# EAGLE board stages_v70 (EAGLE 9.7.0), part 1 of 2
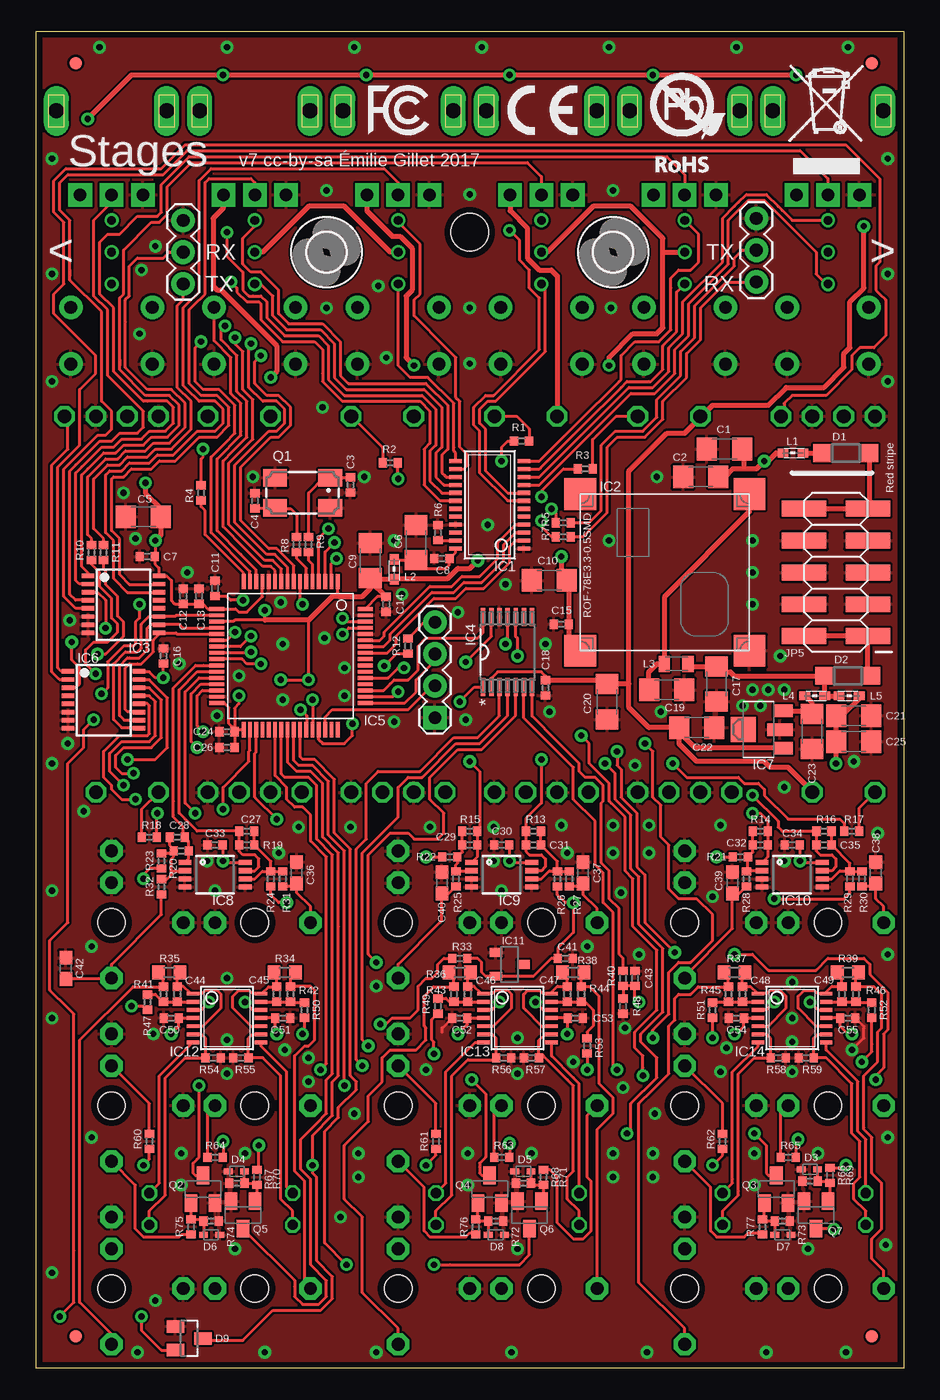
[diagram p6: board, top side]
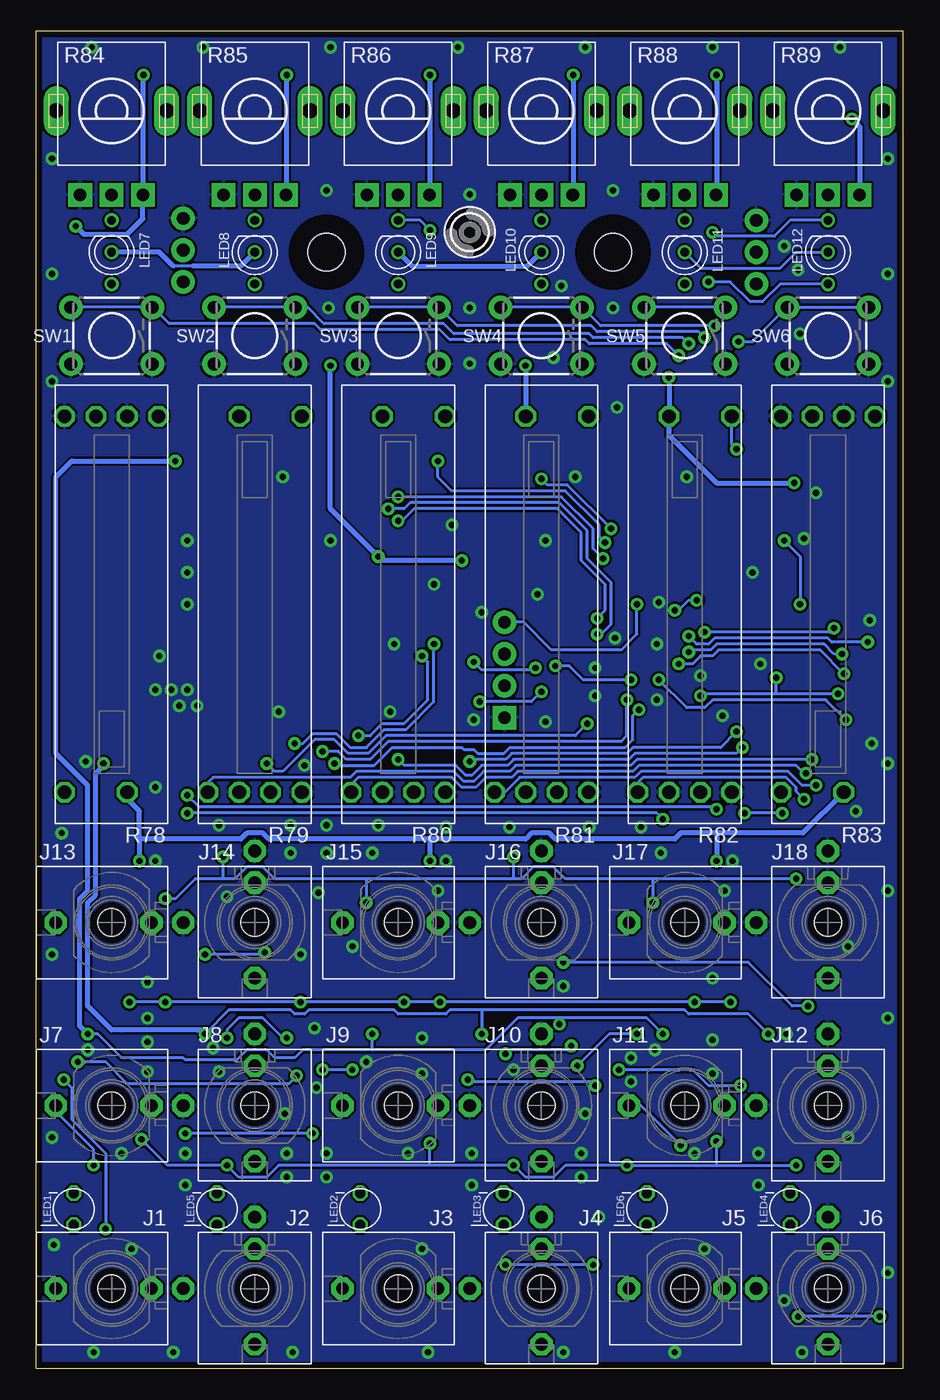
[diagram p7: board, bottom side, seen from below]

Size 69.2 x 106.68 mm. Coordinates in mm from the lower left corner, seen from the top.
Outline: 69.2,0 0,0 0,106.68 69.2,106.68 69.2,0
Copper layers (1*16): Top 0.035mm / dielectric 1.5mm / Bottom 0.035mm
Design rules "PCBCart-Standard": minimum track width 8mil, minimum drill 0.4mm, track to track 7mil, track to pad 7mil, pad to pad 7mil, via to via 7mil, smd to smd 7mil, copper to edge 20mil, drill to drill 8mil, minimum pad ring 8mil, minimum via ring 10mil, stop-mask expansion 3mil, vias tented up to drill 25mil, thermal gap 8mil

## Footprints (pad centres in the part's own frame; a part is rotated, then mirrored left to right if it is on the bottom)
C1206 = smd 1.6 x 1.8: 1 -1.4,0; 2 1.4,0
C0402 = smd 0.65 x 0.75: 1 -0.6,0; 2 0.6,0
C0603 = smd 1.1 x 1: 1 -0.85,0; 2 0.85,0
SOD123 = smd 1.4 x 1.4: A 1.9,0; C -1.9,0
SOD523 = smd 0.7 x 0.5: A 0.7,0; C -0.6,0
SOT23 = smd 1 x 1.4: 1 -0.95,-1.1; 2 0.95,-1.1; 3 0,1.1
3,0 = hole 3: 0,0
3,0TINY = hole 3: 0,0
TSSOP24_0635 = smd 0.33 x 1: 1 -3.493,-2.725; 2 -2.857,-2.725; 3 -2.223,-2.725; 4 -1.587,-2.725; 5 -0.953,-2.725; 6 -0.318,-2.725; 7 0.318,-2.725; 8 0.953,-2.725; 9 1.587,-2.725; 10 2.223,-2.725; 11 2.857,-2.725; 12 3.493,-2.725; 13 3.493,2.725; 14 2.857,2.725; 15 2.223,2.725; 16 1.587,2.725; 17 0.953,2.725; 18 0.318,2.725; 19 -0.318,2.725; 20 -0.953,2.725; 21 -1.587,2.725; 22 -2.223,2.725; 23 -2.857,2.725; 24 -3.493,2.725
ROF78EXX-0.5SMD = smd 2.54 x 2.54: 1 -6.25,6.75; 2 6.25,6.75; 3 6.25,-6.75; 4 -6.25,-6.75
TSSOP16_065 = smd 0.35 x 1: 1 -1.95,-2.825; 2 -1.3,-2.825; 3 -0.65,-2.825; 4 0,-2.825; 5 0.65,-2.825; 6 1.3,-2.825; 7 1.95,-2.825; 8 2.6,-2.825; 9 2.6,2.825; 10 1.95,2.825; 11 1.3,2.825; 12 0.65,2.825; 13 0,2.825; 14 -0.65,2.825; 15 -1.3,2.825; 16 -1.95,2.825
RPDSOG14 = smd 1.422 x 0.356: 1 -2.8,1.95; 2 -2.8,1.3; 3 -2.8,0.65; 4 -2.8,0; 5 -2.8,-0.65; 6 -2.8,-1.3; 7 -2.8,-1.95; 8 2.8,-1.95; 9 2.8,-1.3; 10 2.8,-0.65; 11 2.8,0; 12 2.8,0.65; 13 2.8,1.3; 14 2.8,1.95
TQFP-10X10-64 = smd 1.2 x 0.3: 1 -5.936,3.75; 2 -5.936,3.25; 3 -5.936,2.75; 4 -5.936,2.25; 5 -5.936,1.75; 6 -5.936,1.25; 7 -5.936,0.75; 8 -5.936,0.25; 9 -5.936,-0.25; 10 -5.936,-0.75; 11 -5.936,-1.25; 12 -5.936,-1.75; 13 -5.936,-2.25; 14 -5.936,-2.75; 15 -5.936,-3.25; 16 -5.936,-3.75; 33 5.886,-3.75; 34 5.886,-3.25; 35 5.886,-2.75; 36 5.886,-2.25; 37 5.886,-1.75; 38 5.886,-1.25; 39 5.886,-0.75; 40 5.886,-0.25; 41 5.886,0.25; 42 5.886,0.75; 43 5.886,1.25; 44 5.886,1.75; 45 5.886,2.25; 46 5.886,2.75; 47 5.886,3.25; 48 5.886,3.75 | smd 0.3 x 1.2: 17 -3.75,-5.911; 18 -3.25,-5.911; 19 -2.75,-5.911; 20 -2.25,-5.911; 21 -1.75,-5.911; 22 -1.25,-5.911; 23 -0.75,-5.911; 24 -0.25,-5.911; 25 0.25,-5.911; 26 0.75,-5.911; 27 1.25,-5.911; 28 1.75,-5.911; 29 2.25,-5.911; 30 2.75,-5.911; 31 3.25,-5.911; 32 3.75,-5.911; 49 3.75,5.936; 50 3.25,5.936; 51 2.75,5.936; 52 2.25,5.936; 53 1.75,5.936; 54 1.25,5.936; 55 0.75,5.936; 56 0.25,5.936; 57 -0.25,5.936; 58 -0.75,5.936; 59 -1.25,5.936; 60 -1.75,5.936; 61 -2.25,5.936; 62 -2.75,5.936; 63 -3.25,5.936; 64 -3.75,5.936
SOT89 = smd 1 x 1.5: 1 -1.499,-1.981; 3 1.499,-1.981 | smd 1 x 2: 2 0,-1.727 | smd 2 x 2: 2@1 0,1.194
MSOP-8 = smd 0.41 x 1.02: 1 -0.975,-2.4; 2 -0.325,-2.4; 3 0.325,-2.4; 4 0.975,-2.4; 5 0.975,2.4; 6 0.325,2.4; 7 -0.325,2.4; 8 -0.975,2.4
DBZ_R-PDSO-G3 = smd 0.7 x 1: 1 -0.95,-1.1; 2 0.95,-1.1; 3 0,1.1
TSSOP14_065 = smd 0.305 x 0.991: 1 -1.95,-2.718; 2 -1.3,-2.718; 3 -0.65,-2.718; 4 0,-2.718; 5 0.65,-2.718; 6 1.3,-2.718; 7 1.95,-2.718; 8 1.95,2.718; 9 1.3,2.718; 10 0.65,2.718; 11 0,2.718; 12 -0.65,2.718; 13 -1.3,2.718; 14 -1.95,2.718
WQP_PJ_301M6 = drill 1.016 pad 1.778 octagon: P1 0,-5.715; P2 0,-3.175; P3 0,4.445 | hole 2.2: 0,0
FIDUCIAL-1X2 = smd 1 x 1: 1 0,0
1X03 = drill 1.016 pad 1.88: 1 0,0; 2 2.54,0; 3 5.08,0
2X5-SMD = smd 3.556 x 1.27: 1 -2.54,5.08; 2 2.54,5.08; 3 -2.54,2.54; 4 2.54,2.54; 5 -2.54,0; 6 2.54,0; 7 -2.54,-2.54; 8 2.54,-2.54; 9 -2.54,-5.08; 10 2.54,-5.08
1X04 = drill 1.016 pad 1.88 square: 1 0,0 | drill 1.016 pad 1.88: 2 2.54,0; 3 5.08,0; 4 7.62,0
0603 = smd 0.85 x 0.7: 1 -0.9,0; 2 0.7,0
L2012C = smd 0.9 x 1.25: 1 -0.9,0; 2 1,0
LED3MM = drill 0.813 octagon: 1 -1.27,0; 2 1.27,0
LED-BICOLOR-THROUGHHOLE-LUMEX = drill 0.7: A 0,0; GREEN_C 2.54,0; RED_C -2.54,0
CTS406 = smd 1.9 x 1.4: 1 -2.2,-1.2; 2 2.2,-1.2; 3 2.2,1.2; 4 -2.2,1.2
SOT23-BEC = smd 1 x 1.4: B -0.95,-1.1; C 0,1.1; E 0.95,-1.1
R0402 = smd 0.65 x 0.75: 1 -0.6,0; 2 0.6,0
R0603 = smd 1 x 1.1: 1 -0.85,0; 2 0.85,0
BOURNS_SLIDER = drill 1.1 octagon: 1 -15,1.25; 2 -15,3.75; 3 15,1.25; B 15,-3.75; DUMMY -15,-1.25; E -15,-3.75
ALPS_POT_NARROW = drill 1 pad 1.88 square: P$1 -2.5,6.7; P$2 0,6.7; P$3 2.5,6.7 | drill 1.2 pad 2 long: P$4 -4.4,0; P$5 4.4,0
TACTILE-PTH = drill 1.016 pad 1.88: 1 -3.251,2.261; 2 3.251,2.261; 3 -3.251,-2.261; 4 3.251,-2.261

## Placement (x,y rotation side)
C1  22u  [C1206]  54.91,73.34 0 top
C2  22u  [C1206]  53,71.12 0 top
C3  20p  [C0402]  25.06,70.48 90 top
C4  20p  [C0402]  17.44,69.21 270 top
C5  22u  [C1206]  8.55,67.94 180 top
C6  22u  [C1206]  30.3,65.88 90 top
C7  100n  [C0402]  8.87,64.77 180 top
C8  100n  [C0402]  32.36,64.61 180 top
C9  22u  [C1206]  26.65,64.45 90 top
C10  22u  [C1206]  40.94,62.87 180 top
C11  100n  [C0402]  14.27,62.23 90 top
C12  1u  [C0402]  11.73,61.59 90 top
C13  100n  [C0402]  13,61.59 90 top
C14  100n  [C0402]  27.92,60.96 270 top
C15  100n  [C0402]  41.89,59.37 180 top
C16  100n  [C0402]  10.14,56.83 90 top
C17  22u  [C1206]  54.27,54.61 270 top
C18  1u  [C0402]  40.62,54.29 270 top
C19  22u  [C1206]  50.3,54.13 0 top
C20  22u  [C1206]  45.54,53.18 270 top
C21  22u  [C1206]  65.23,52.07 0 top
C22  22u  [C1206]  52.68,51.12 0 top
C23  22u  [C1206]  61.89,50.8 270 top
C24  100n  [C0402]  15.22,50.8 180 top
C25  22u  [C1206]  65.23,50.01 0 top
C26  1u  [C0402]  15.22,49.53 180 top
C27  2.2n  [C0402]  16.81,42.86 180 top
C28  470p  [C0402]  11.25,42.39 0 top
C29  2.2n  [C0402]  34.59,41.75 0 top
C30  100n  [C0402]  37.13,41.75 180 top
C31  2.2n  [C0402]  39.67,41.75 180 top
C32  2.2n  [C0402]  57.76,41.75 0 top
C33  100n  [C0402]  14.27,41.75 180 top
C34  100n  [C0402]  60.3,41.75 180 top
C35  2.2n  [C0402]  62.84,41.75 180 top
C36  ESD  [C0603]  20.78,39.53 90 top
C37  ESD  [C0603]  43.64,39.53 90 top
C38  ESD  [C0603]  66.97,39.53 90 top
C39  ESD  [C0603]  55.54,38.74 90 top
C40  ESD  [C0603]  32.37,38.73 90 top
C41  1u  [C0402]  42.21,32.7 0 top
C42  ESD  [C0603]  2.36,31.91 90 top
C43  1u  [C0402]  47.76,31.11 90 top
C44  100p  [C0402]  11.25,29.84 90 top
C45  100p  [C0402]  19.19,29.84 90 top
C46  100p  [C0402]  34.43,29.84 90 top
C47  100p  [C0402]  42.37,29.84 90 top
C48  100p  [C0402]  56.34,29.84 90 top
C49  100p  [C0402]  64.27,29.84 90 top
C50  100n  [C0402]  10.77,27.94 180 top
C51  100n  [C0402]  19.66,27.94 180 top
C52  100n  [C0402]  33.79,27.94 180 top
C53  100n  [C0402]  43,27.94 180 top
C54  100n  [C0402]  55.86,27.94 180 top
C55  100n  [C0402]  64.75,27.94 180 top
D1  1N5819HW  [SOD123]  64.59,73.03 180 top
D2  1N5819HW  [SOD123]  64.75,55.24 0 top
D3  1N4148  [SOD523]  61.73,15.88 180 top
D4  1N4148  [SOD523]  16.01,15.72 180 top
D5  1N4148  [SOD523]  38.87,15.72 180 top
D6  1N4148  [SOD523]  13.95,10.64 0 top
D7  1N4148  [SOD523]  59.51,10.64 0 top
D8  1N4148  [SOD523]  36.65,10.64 0 top
D9  BAT54S  [SOT23]  12.2,2.38 270 top
H1  MOUNT-HOLE3.0  [3,0]  46.02,89.06 0 top
H2  MOUNT-HOLE3.0  [3,0]  23.16,89.06 0 top
H3  MOUNT-HOLE3.0TINY  [3,0TINY]  34.59,90.65 0 bottom
IC1  TLC59281DBQ  [TSSOP24_0635]  36.17,68.9 90 top
IC2  ROF-78E3.3-0.5SMD  [ROF78EXX-0.5SMD]  50.14,63.5 270 top
IC3  4051PW  [TSSOP16_065]  6.97,61.28 270 top
IC4  DAC8168IAPW  [RPDSOG14]  37.6,57.15 90 top
IC5  STM32F373RBT6  [TQFP-10X10-64]  20.3,56.83 270 top
IC6  4051PW  [TSSOP16_065]  5.38,53.66 270 top
IC7  LD2981ABU33  [SOT89]  57.61,50.96 90 top
IC8  MCP6002  [MSOP-8]  14.27,39.37 270 top
IC9  MCP6002  [MSOP-8]  37.13,39.37 270 top
IC10  MCP6002  [MSOP-8]  60.3,39.37 270 top
IC11  LM4040B25  [DBZ_R-PDSO-G3]  37.76,32.23 270 top
IC12  TL074PW  [TSSOP14_065]  15.22,27.94 270 top
IC13  TL074PW  [TSSOP14_065]  38.4,27.94 270 top
IC14  TL074PW  [TSSOP14_065]  60.3,27.94 270 top
J1  PJ301_THONKICONN6  [WQP_PJ_301M6]  63.16,6.35 90 bottom
J2  PJ301_THONKICONN6  [WQP_PJ_301M6]  51.73,6.35 180 bottom
J3  PJ301_THONKICONN6  [WQP_PJ_301M6]  40.3,6.35 90 bottom
J4  PJ301_THONKICONN6  [WQP_PJ_301M6]  28.87,6.35 180 bottom
J5  PJ301_THONKICONN6  [WQP_PJ_301M6]  17.44,6.35 90 bottom
J6  PJ301_THONKICONN6  [WQP_PJ_301M6]  6.01,6.35 180 bottom
J7  PJ301_THONKICONN6  [WQP_PJ_301M6]  63.16,20.95 90 bottom
J8  PJ301_THONKICONN6  [WQP_PJ_301M6]  51.73,20.95 180 bottom
J9  PJ301_THONKICONN6  [WQP_PJ_301M6]  40.3,20.95 90 bottom
J10  PJ301_THONKICONN6  [WQP_PJ_301M6]  28.87,20.95 180 bottom
J11  PJ301_THONKICONN6  [WQP_PJ_301M6]  17.44,20.95 90 bottom
J12  PJ301_THONKICONN6  [WQP_PJ_301M6]  6.01,20.95 180 bottom
J13  PJ301_THONKICONN6  [WQP_PJ_301M6]  63.16,35.56 90 bottom
J14  PJ301_THONKICONN6  [WQP_PJ_301M6]  51.73,35.56 180 bottom
J15  PJ301_THONKICONN6  [WQP_PJ_301M6]  40.3,35.56 90 bottom
J16  PJ301_THONKICONN6  [WQP_PJ_301M6]  28.87,35.56 180 bottom
J17  PJ301_THONKICONN6  [WQP_PJ_301M6]  17.44,35.56 90 bottom
J18  PJ301_THONKICONN6  [WQP_PJ_301M6]  6.01,35.56 180 bottom
JP1  FIDUCIAL1X2  [FIDUCIAL-1X2]  3.15,104.14 0 top
JP2  FIDUCIAL1X2  [FIDUCIAL-1X2]  66.66,104.14 0 top
JP3  [1X03]  57.45,91.76 270 top
JP4  [1X03]  11.73,91.6 270 top
JP5  M05X2SMD  [2X5-SMD]  63.8,63.5 180 top
JP6  [1X04]  31.81,51.91 90 top
JP7  FIDUCIAL1X2  [FIDUCIAL-1X2]  3.15,2.54 0 top
JP8  FIDUCIAL1X2  [FIDUCIAL-1X2]  66.66,2.54 0 top
L1  [0603]  60.46,73.03 0 top
L2  [0603]  28.56,63.66 270 top
L3  33u  [L2012C]  51.1,56.2 180 top
L4  [0603]  62.21,53.66 0 top
L5  [0603]  64.75,53.66 180 top
LED1  WP937EGW  [LED3MM]  66.18,12.7 270 bottom
LED2  WP937EGW  [LED3MM]  43.32,12.7 270 bottom
LED3  WP937EGW  [LED3MM]  31.89,12.7 270 bottom
LED4  WP937EGW  [LED3MM]  9.03,12.7 270 bottom
LED5  WP937EGW  [LED3MM]  54.75,12.7 270 bottom
LED6  WP937EGW  [LED3MM]  20.46,12.7 270 bottom
LED7  SSL-LX3059IGW-CA  [LED-BICOLOR-THROUGHHOLE-LUMEX]  63.16,89.06 270 bottom
LED8  SSL-LX3059IGW-CA  [LED-BICOLOR-THROUGHHOLE-LUMEX]  51.73,89.06 270 bottom
LED9  SSL-LX3059IGW-CA  [LED-BICOLOR-THROUGHHOLE-LUMEX]  40.3,89.06 270 bottom
LED10  SSL-LX3059IGW-CA  [LED-BICOLOR-THROUGHHOLE-LUMEX]  28.87,89.06 270 bottom
LED11  SSL-LX3059IGW-CA  [LED-BICOLOR-THROUGHHOLE-LUMEX]  17.44,89.06 270 bottom
LED12  SSL-LX3059IGW-CA  [LED-BICOLOR-THROUGHHOLE-LUMEX]  6.01,89.06 270 bottom
Q1  8MHz  [CTS406]  21.25,69.85 180 top
Q2  MMBT3904  [SOT23-BEC]  13.32,14.29 0 top
Q3  MMBT3904  [SOT23-BEC]  59.03,14.29 0 top
Q4  MMBT3904  [SOT23-BEC]  36.18,14.29 0 top
Q5  MMBT3904  [SOT23-BEC]  16.49,12.22 180 top
Q6  MMBT3904  [SOT23-BEC]  39.35,12.22 180 top
Q7  MMBT3904  [SOT23-BEC]  62.21,12.22 180 top
R1  15k  [R0402]  38.71,73.98 180 top
R2  15k  [R0402]  28.24,72.23 0 top
R3  15k  [R0402]  43.8,71.75 180 top
R4  15k  [R0402]  13.16,69.85 270 top
R5  100  [R0402]  42.05,67.47 0 top
R6  10k  [R0402]  32.05,66.68 90 top
R7  100  [R0402]  42.05,66.36 0 top
R8  100  [R0402]  20.78,65.72 90 top
R9  100  [R0402]  21.73,65.72 90 top
R10  100  [R0402]  4.43,65.09 90 top
R11  100  [R0402]  5.38,65.09 90 top
R12  10k  [R0402]  29.67,57.63 270 top
R13  20k  [R0402]  39.67,42.86 0 top
R14  20k  [R0402]  57.76,42.86 180 top
R15  20k  [R0402]  34.59,42.86 180 top
R16  20k  [R0402]  62.84,42.86 0 top
R17  15k  [R0402]  65.07,42.86 180 top
R18  15k  [R0402]  9.03,42.39 0 top
R19  20k  [R0402]  16.81,41.75 0 top
R20  20k  [R0402]  11.57,41.27 180 top
R21  30k  [R0402]  56.18,40.8 180 top
R22  30k  [R0402]  33,40.8 180 top
R23  30k  [R0402]  9.98,40.48 270 top
R24  30k  [R0402]  18.71,39.05 270 top
R25  100k  [R0402]  33.48,39.05 270 top
R26  30k  [R0402]  41.57,39.05 270 top
R27  100k  [R0402]  42.53,39.05 270 top
R28  100k  [R0402]  56.65,39.05 270 top
R29  30k  [R0402]  64.91,39.05 270 top
R30  100k  [R0402]  65.86,39.05 270 top
R31  100k  [R0402]  19.66,39.05 270 top
R32  100k  [R0402]  9.98,38.42 270 top
R33  10k  [R0402]  33.79,32.7 0 top
R34  1.0k  [R0603]  19.82,31.59 180 top
R35  1.0k  [R0603]  10.62,31.59 0 top
R36  1.0k  [R0603]  33.79,31.59 0 top
R37  1.0k  [R0603]  55.7,31.59 0 top
R38  1.0k  [R0603]  42.84,31.59 180 top
R39  1.0k  [R0603]  64.75,31.59 180 top
R40  130k  [R0402]  46.81,31.11 90 top
R41  130k  [R0402]  10.14,29.84 270 top
R42  130k  [R0402]  20.3,29.84 270 top
R43  130k  [R0402]  33.32,29.84 270 top
R44  130k  [R0402]  43.48,29.84 270 top
R45  130k  [R0402]  55.22,29.84 270 top
R46  130k  [R0402]  65.39,29.84 270 top
R47  20k  [R0402]  8.87,29.21 270 top
R48  100k  [R0402]  46.81,28.89 90 top
R49  20k  [R0402]  32.05,28.89 270 top
R50  20k  [R0402]  21.41,28.57 270 top
R51  20k  [R0402]  53.95,28.57 270 top
R52  20k  [R0402]  66.66,28.57 270 top
R53  20k  [R0402]  43.95,25.72 270 top
R54  1.0k  [R0402]  14.11,24.77 0 top
R55  1.0k  [R0402]  16.33,24.77 180 top
R56  1.0k  [R0402]  37.29,24.77 0 top
R57  1.0k  [R0402]  39.51,24.77 180 top
R58  1.0k  [R0402]  59.19,24.77 0 top
R59  1.0k  [R0402]  61.42,24.77 180 top
R60  10k  [R0402]  9.03,18.1 90 top
R61  10k  [R0402]  31.89,18.1 90 top
R62  10k  [R0402]  54.75,18.1 90 top
R63  10k  [R0402]  37.13,16.83 180 top
R64  10k  [R0402]  14.27,16.83 180 top
R65  10k  [R0402]  59.99,16.83 180 top
R66  100k  [R0402]  63.32,15.4 270 top
R67  100k  [R0402]  17.6,15.24 270 top
R68  100k  [R0402]  40.46,15.24 270 top
R69  100k  [R0402]  61.73,14.92 0 top
R70  100k  [R0402]  16.01,14.76 0 top
R71  100k  [R0402]  38.87,14.76 0 top
R72  100k  [R0402]  36.65,11.75 180 top
R73  100k  [R0402]  59.51,11.75 180 top
R74  100k  [R0402]  13.95,11.75 180 top
R75  100k  [R0402]  12.36,11.27 90 top
R76  100k  [R0402]  35.06,11.27 90 top
R77  100k  [R0402]  57.92,11.27 90 top
R78  20kB  [BOURNS_SLIDER]  63.16,60.96 270 bottom
R79  20kB  [BOURNS_SLIDER]  51.73,60.96 90 bottom
R80  20kB  [BOURNS_SLIDER]  40.3,60.96 90 bottom
R81  20kB  [BOURNS_SLIDER]  28.87,60.96 90 bottom
R82  20kB  [BOURNS_SLIDER]  17.44,60.96 90 bottom
R83  20kB  [BOURNS_SLIDER]  6.01,60.96 270 bottom
R84  10kB  [ALPS_POT_NARROW]  63.16,100.33 180 bottom
R85  10kB  [ALPS_POT_NARROW]  51.73,100.33 180 bottom
R86  10kB  [ALPS_POT_NARROW]  40.3,100.33 180 bottom
R87  10kB  [ALPS_POT_NARROW]  28.87,100.33 180 bottom
R88  10kB  [ALPS_POT_NARROW]  17.44,100.33 180 bottom
R89  10kB  [ALPS_POT_NARROW]  6.01,100.33 180 bottom
SW1  [TACTILE-PTH]  63.16,82.39 180 bottom
SW2  [TACTILE-PTH]  51.73,82.39 180 bottom
SW3  [TACTILE-PTH]  40.3,82.39 180 bottom
SW4  [TACTILE-PTH]  28.87,82.39 180 bottom
SW5  [TACTILE-PTH]  17.44,82.39 180 bottom
SW6  [TACTILE-PTH]  6.01,82.39 180 bottom
U$1  [ROHS]  48.88,95.25 0 top
U$2  [ROHS_2]  59.99,95.25 0 top
U$3  [FCC_SMALL]  26.49,98.42 0 top
U$4  [CE_SMALL]  37.6,98.42 0 top